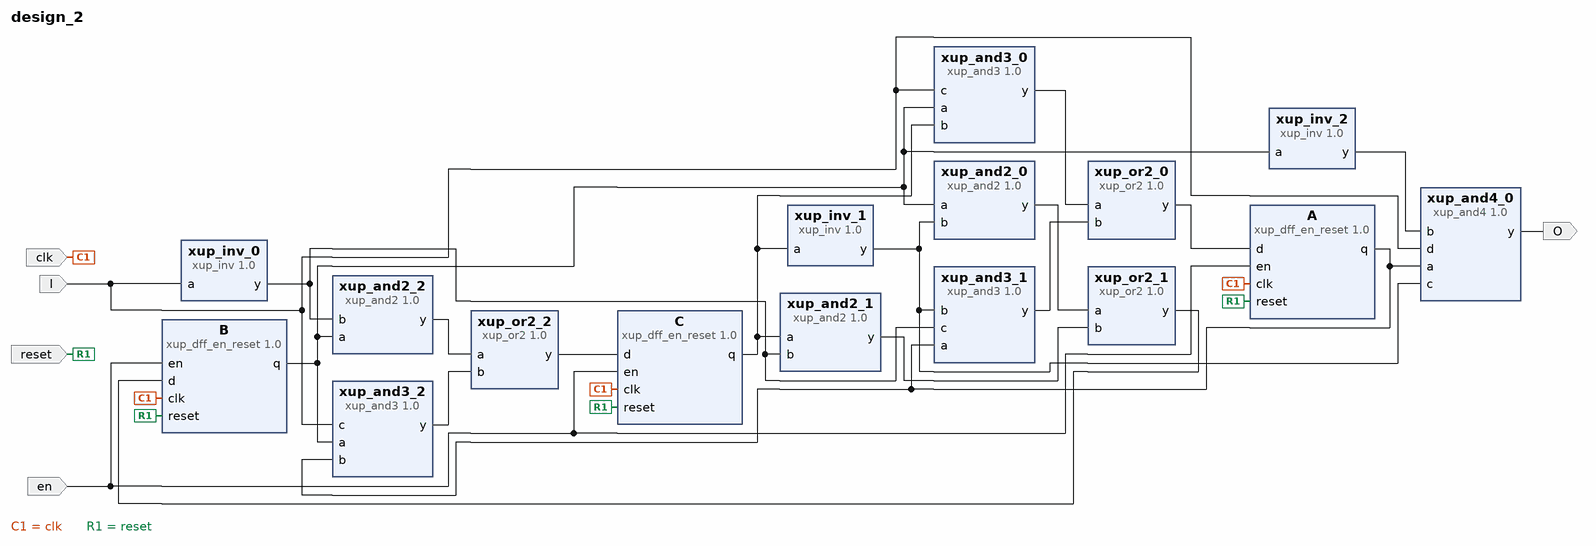
[diagram p0: block diagram of the top level]
# Vivado block design design_2, xc7a35tcpg236-1, Vivado 2023.1
create_bd_design design_2

create_bd_port -dir I I
create_bd_port -dir O O
create_bd_port -dir I clk
create_bd_port -dir I en
create_bd_port -dir I reset

create_bd_cell -type ip -vlnv xilinx.com:XUP:xup_dff_en_reset:1.0 A
create_bd_cell -type ip -vlnv xilinx.com:XUP:xup_dff_en_reset:1.0 B
create_bd_cell -type ip -vlnv xilinx.com:XUP:xup_dff_en_reset:1.0 C
create_bd_cell -type ip -vlnv xilinx.com:XUP:xup_and2:1.0 xup_and2_0
create_bd_cell -type ip -vlnv xilinx.com:XUP:xup_and2:1.0 xup_and2_1
create_bd_cell -type ip -vlnv xilinx.com:XUP:xup_and2:1.0 xup_and2_2
create_bd_cell -type ip -vlnv xilinx.com:XUP:xup_and3:1.0 xup_and3_0
create_bd_cell -type ip -vlnv xilinx.com:XUP:xup_and3:1.0 xup_and3_1
create_bd_cell -type ip -vlnv xilinx.com:XUP:xup_and3:1.0 xup_and3_2
create_bd_cell -type ip -vlnv xilinx.com:XUP:xup_and4:1.0 xup_and4_0
create_bd_cell -type ip -vlnv xilinx.com:XUP:xup_inv:1.0 xup_inv_0
create_bd_cell -type ip -vlnv xilinx.com:XUP:xup_inv:1.0 xup_inv_1
create_bd_cell -type ip -vlnv xilinx.com:XUP:xup_inv:1.0 xup_inv_2
create_bd_cell -type ip -vlnv xilinx.com:XUP:xup_or2:1.0 xup_or2_0
create_bd_cell -type ip -vlnv xilinx.com:XUP:xup_or2:1.0 xup_or2_1
create_bd_cell -type ip -vlnv xilinx.com:XUP:xup_or2:1.0 xup_or2_2

# ---- connections ----

connect_bd_net [get_bd_pins A/q] [get_bd_pins xup_and3_1/a] [get_bd_pins xup_and3_2/b] [get_bd_pins xup_and4_0/a]
connect_bd_net [get_bd_pins B/q] \
  [get_bd_pins xup_and3_0/a] [get_bd_pins xup_and2_0/a] [get_bd_pins xup_and2_2/a] [get_bd_pins xup_and3_2/a] \
  [get_bd_pins xup_inv_2/a]
connect_bd_net [get_bd_pins C/q] [get_bd_pins xup_and3_0/b] [get_bd_pins xup_inv_1/a] [get_bd_pins xup_and2_1/a]
connect_bd_net [get_bd_ports I] [get_bd_pins xup_and3_0/c] [get_bd_pins xup_inv_0/a] [get_bd_pins xup_and3_2/c] [get_bd_pins xup_and4_0/d]
connect_bd_net [get_bd_ports clk] [get_bd_pins C/clk] [get_bd_pins B/clk] [get_bd_pins A/clk]
connect_bd_net [get_bd_ports en] [get_bd_pins C/en] [get_bd_pins B/en] [get_bd_pins A/en]
connect_bd_net [get_bd_ports reset] [get_bd_pins C/reset] [get_bd_pins B/reset] [get_bd_pins A/reset]
connect_bd_net [get_bd_pins xup_and2_0/y] [get_bd_pins xup_or2_1/a]
connect_bd_net [get_bd_pins xup_and2_1/y] [get_bd_pins xup_or2_1/b]
connect_bd_net [get_bd_pins xup_and2_2/y] [get_bd_pins xup_or2_2/a]
connect_bd_net [get_bd_pins xup_and3_0/y] [get_bd_pins xup_or2_0/a]
connect_bd_net [get_bd_pins xup_and3_1/y] [get_bd_pins xup_or2_0/b]
connect_bd_net [get_bd_pins xup_and3_2/y] [get_bd_pins xup_or2_2/b]
connect_bd_net [get_bd_pins xup_and4_0/y] [get_bd_ports O]
connect_bd_net [get_bd_pins xup_inv_0/y] [get_bd_pins xup_and3_1/c] [get_bd_pins xup_and2_1/b] [get_bd_pins xup_and2_2/b]
connect_bd_net [get_bd_pins xup_inv_1/y] [get_bd_pins xup_and3_1/b] [get_bd_pins xup_and2_0/b] [get_bd_pins xup_and4_0/c]
connect_bd_net [get_bd_pins xup_inv_2/y] [get_bd_pins xup_and4_0/b]
connect_bd_net [get_bd_pins xup_or2_0/y] [get_bd_pins A/d]
connect_bd_net [get_bd_pins xup_or2_1/y] [get_bd_pins B/d]
connect_bd_net [get_bd_pins xup_or2_2/y] [get_bd_pins C/d]

validate_bd_design
save_bd_design
